# EAGLE design MyMacropad (EAGLE 9.6.2)
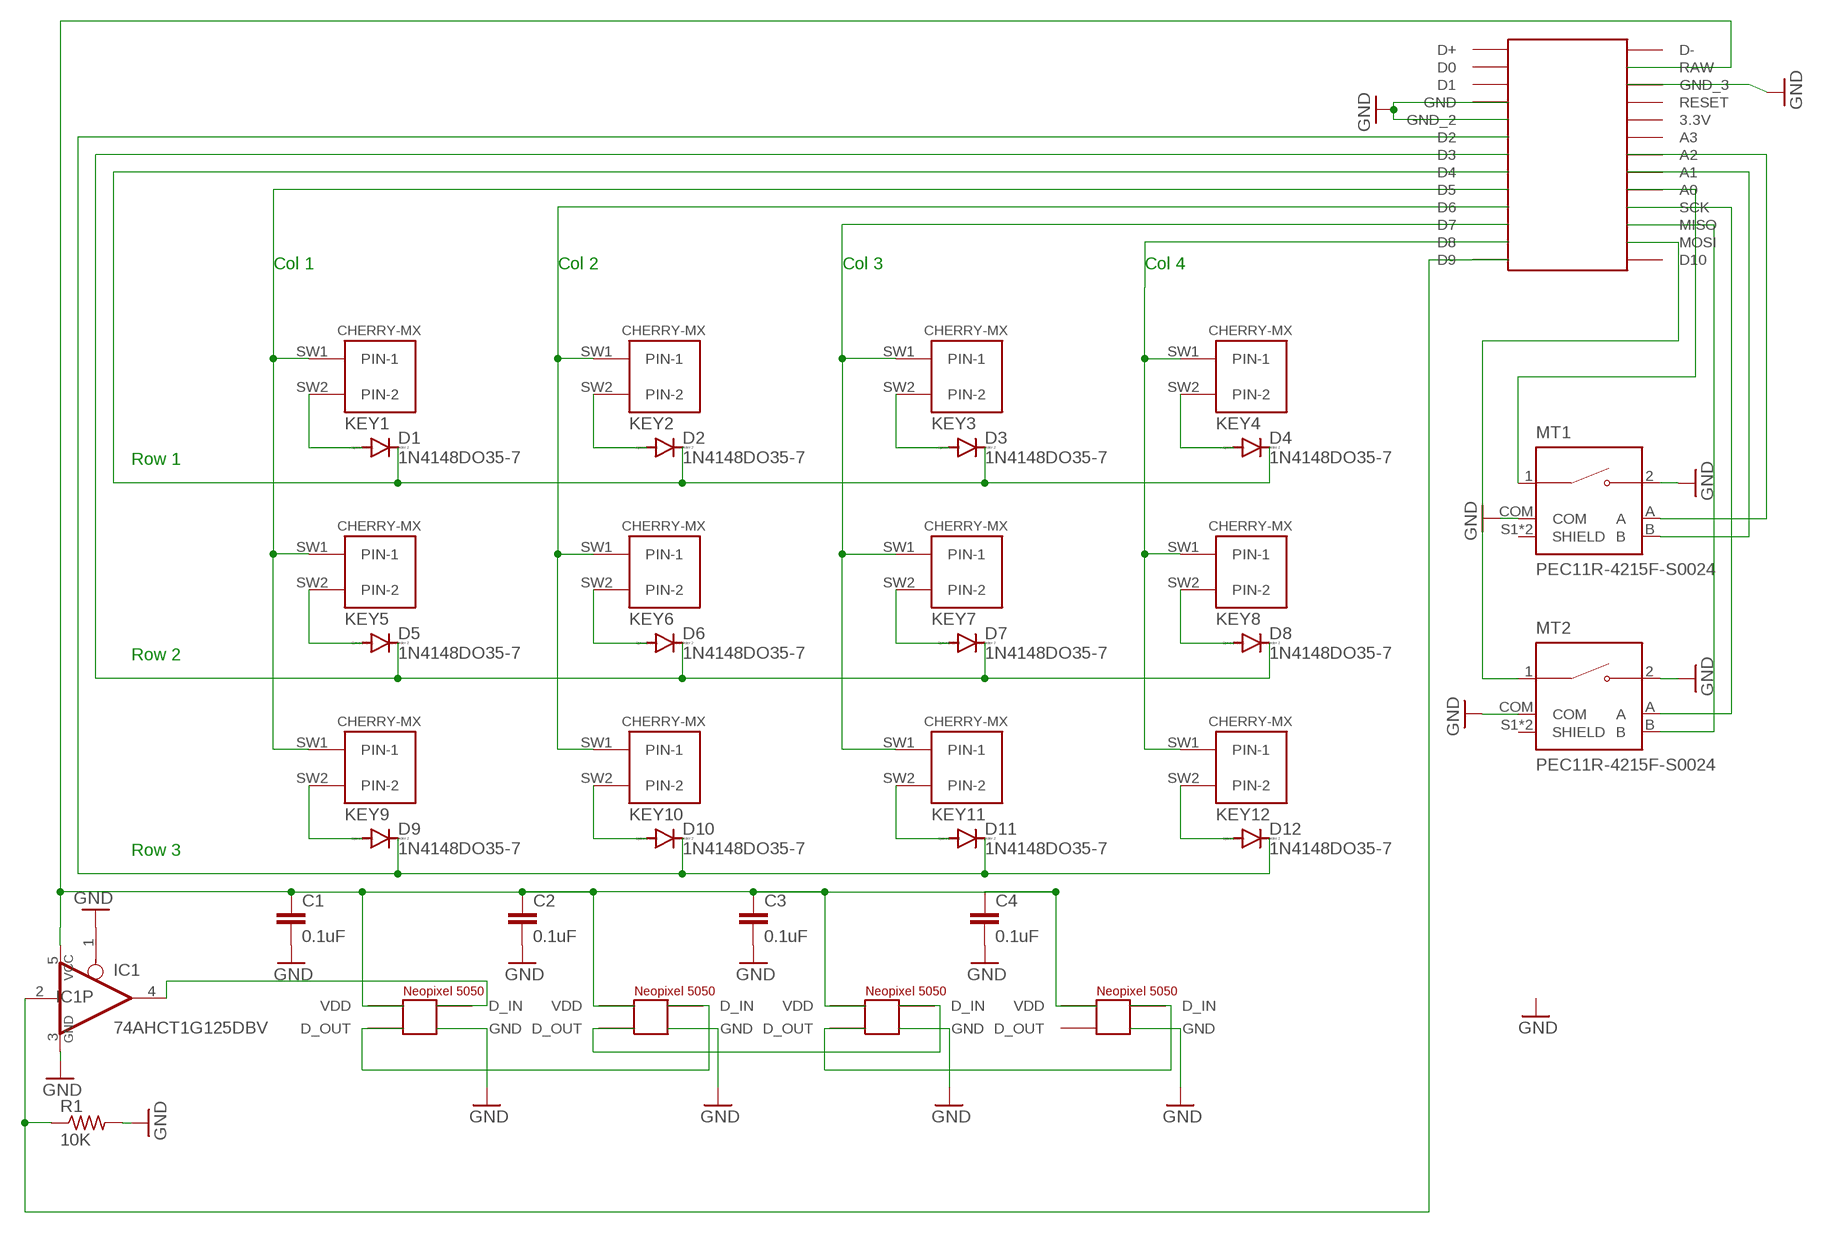
[diagram p0: schematic, sheet 1]

## Parts
C1  0.1uF  0.1UF-KIT-EZ-50V-20%  [CAP-PTH-SMALL-KIT]
C2  0.1uF  0.1UF-KIT-EZ-50V-20%  [CAP-PTH-SMALL-KIT]
C3  0.1uF  0.1UF-KIT-EZ-50V-20%  [CAP-PTH-SMALL-KIT]
C4  0.1uF  0.1UF-KIT-EZ-50V-20%  [CAP-PTH-SMALL-KIT]
D1  1N4148DO35-7  [DO35-7]
D2  1N4148DO35-7  [DO35-7]
D3  1N4148DO35-7  [DO35-7]
D4  1N4148DO35-7  [DO35-7]
D5  1N4148DO35-7  [DO35-7]
D6  1N4148DO35-7  [DO35-7]
D7  1N4148DO35-7  [DO35-7]
D8  1N4148DO35-7  [DO35-7]
D9  1N4148DO35-7  [DO35-7]
D10  1N4148DO35-7  [DO35-7]
D11  1N4148DO35-7  [DO35-7]
D12  1N4148DO35-7  [DO35-7]
IC1  74AHCT1G125DBV  [SOT23-5]
KEY1  CHERRY-MX  [CHERRY-MX]
KEY2  CHERRY-MX  [CHERRY-MX]
KEY3  CHERRY-MX  [CHERRY-MX]
KEY4  CHERRY-MX  [CHERRY-MX]
KEY5  CHERRY-MX  [CHERRY-MX]
KEY6  CHERRY-MX  [CHERRY-MX]
KEY7  CHERRY-MX  [CHERRY-MX]
KEY8  CHERRY-MX  [CHERRY-MX]
KEY9  CHERRY-MX  [CHERRY-MX]
KEY10  CHERRY-MX  [CHERRY-MX]
KEY11  CHERRY-MX  [CHERRY-MX]
KEY12  CHERRY-MX  [CHERRY-MX]
MT1  PEC11R-4215F-S0024  [XDCR_PEC11R-4215F-S0024]
MT2  PEC11R-4215F-S0024  [XDCR_PEC11R-4215F-S0024]
NEOPIXEL_1  NEOPIXEL_5050  [NEOPIXEL_5050]
NEOPIXEL_2  NEOPIXEL_5050  [NEOPIXEL_5050]
NEOPIXEL_3  NEOPIXEL_5050  [NEOPIXEL_5050]
NEOPIXEL_4  NEOPIXEL_5050  [NEOPIXEL_5050]
R1  10K  R-US_V234/12  [V234/12]
U$5  KB2040  [KB2040]

## Nets
GND: C1.2 C2.2 C3.2 C4.2 IC1.1(OE) IC1.3(GND) MT1.2 MT1.COM MT2.2 MT2.COM NEOPIXEL_1.GND NEOPIXEL_2.GND NEOPIXEL_3.GND NEOPIXEL_4.GND R1.2 U$5.GND U$5.GND_2 U$5.GND_3
N$1: KEY1.SW1(PIN-1) KEY5.SW1(PIN-1) KEY9.SW1(PIN-1) U$5.D5
N$2: KEY2.SW1(PIN-1) KEY6.SW1(PIN-1) KEY10.SW1(PIN-1) U$5.D6
N$3: KEY3.SW1(PIN-1) KEY7.SW1(PIN-1) KEY11.SW1(PIN-1) U$5.D7
N$4: D1.A KEY1.SW2(PIN-2)
N$5: KEY4.SW1(PIN-1) KEY8.SW1(PIN-1) KEY12.SW1(PIN-1) U$5.D8
N$6: D2.A KEY2.SW2(PIN-2)
N$7: D6.A KEY6.SW2(PIN-2)
N$8: D10.A KEY10.SW2(PIN-2)
N$9: D9.A KEY9.SW2(PIN-2)
N$10: D7.A KEY7.SW2(PIN-2)
N$11: D11.A KEY11.SW2(PIN-2)
N$12: D3.A KEY3.SW2(PIN-2)
N$13: D4.A KEY4.SW2(PIN-2)
N$14: D8.A KEY8.SW2(PIN-2)
N$15: D12.A KEY12.SW2(PIN-2)
N$16: D1.C D2.C D3.C D4.C U$5.D4
N$17: IC1.4(O) NEOPIXEL_1.D_IN
N$18: NEOPIXEL_3.D_OUT NEOPIXEL_4.D_IN
N$19: D5.A KEY5.SW2(PIN-2)
N$20: NEOPIXEL_1.D_OUT NEOPIXEL_2.D_IN
N$21: D5.C D6.C D7.C D8.C U$5.D3
N$22: D9.C D10.C D11.C D12.C U$5.D2
N$23: NEOPIXEL_2.D_OUT NEOPIXEL_3.D_IN
N$24: IC1.2(I) R1.1 U$5.D9
N$25: C1.1 C2.1 C3.1 C4.1 IC1.5(VCC) NEOPIXEL_1.VDD NEOPIXEL_2.VDD NEOPIXEL_3.VDD NEOPIXEL_4.VDD U$5.RAW
N$26: MT1.A U$5.A2
N$27: MT1.B U$5.A1
N$28: MT1.1 U$5.A0
N$29: MT2.1 U$5.MOSI
N$30: MT2.A U$5.SCK
N$31: MT2.B U$5.MISO
Unconnected: MT1.S1(SHIELD) MT1.S2(SHIELD) MT2.S1(SHIELD) MT2.S2(SHIELD) NEOPIXEL_4.D_OUT U$5.3.3V U$5.A3 U$5.D0 U$5.D1 U$5.D10 U$5.D+ U$5.D- U$5.RESET

## Notes on the sheet
- Col 1 | Col 2 | Col 3 | Col 4
- Row 1
- Row 2
- Row 3

## Library data of the parts
C1-C4 = SparkFun-Capacitors:0.1UF: 0.1µF ceramic capacitors A capacitor is a passive two-terminal electrical component used to store electrical energy temporarily in an electric field.; PROD_ID: CAP-08370
D1-D12 = diode:1N4148: DIODE high speed (Philips)
IC1 = 74xx-little-us:74*1G125: Single Bus Buffer Gate with 3-State Output
KEY1-KEY12 = cherrymx:CHERRY-MX: Cherry MX series keyswitch
MT1 MT2 = PEC11R-4215F-S0024:PEC11R-4215F-S0024: Incremental Encoder, 12 Mm, Contact Rating 10 Ma - 5 Vdc Check availability <https://pricing.snapeda.com/parts/PEC11R-4215F-S0024/Bourns/view-part?ref=eda>; AVAILABILITY: In Stock; DESCRIPTION: Rotary Encoder Mechanical 24 Quadrature (Incremental) Vertical; MF: Bourns; MP: PEC11R-4215F-S0024; PACKAGE: None; PRICE: None; PURCHASE-URL: https://pricing.snapeda.com/search/part/PEC11R-4215F-S0024/?ref=eda
NEOPIXEL_1-NEOPIXEL_4 = Neopixel 5050:NEOPIXEL_5050: Neopixel 5050 SMD Component
R1 = adafruit:R-US_: RESISTOR, American symbol
U$5 = KB2040:KB2040: Adafruit Kee Boar 2040 board

## Board
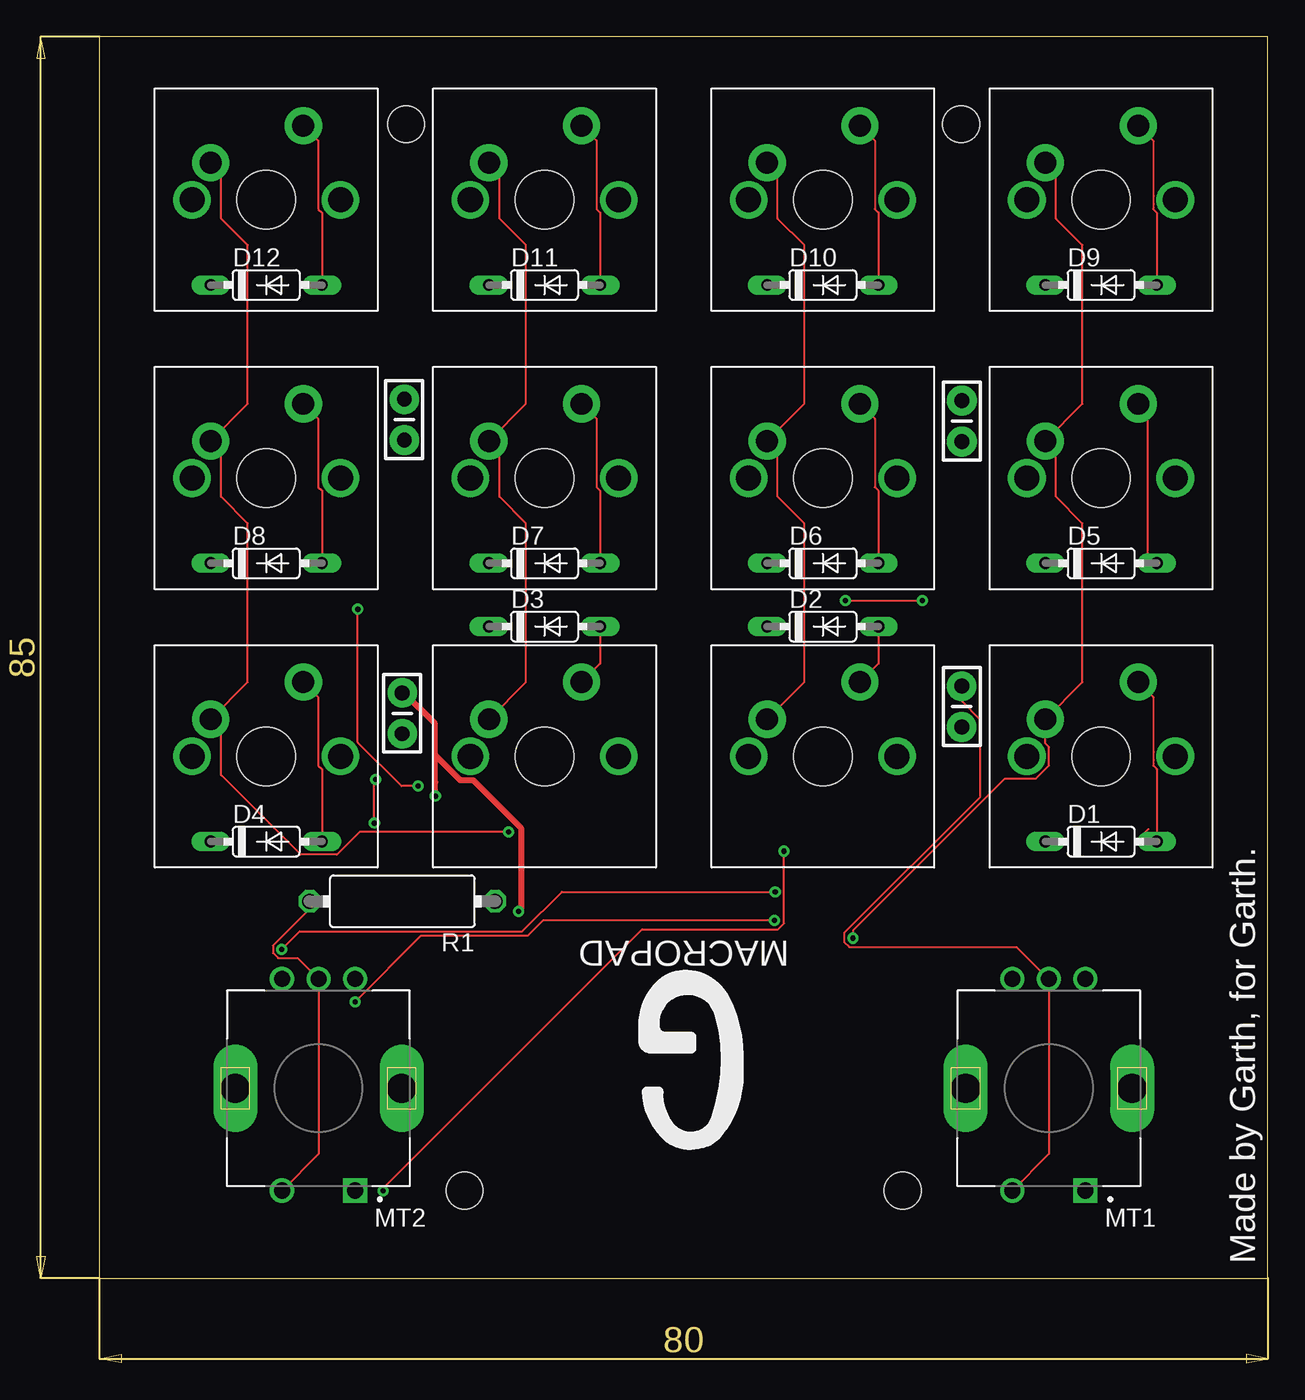
[diagram p1: board, top side]
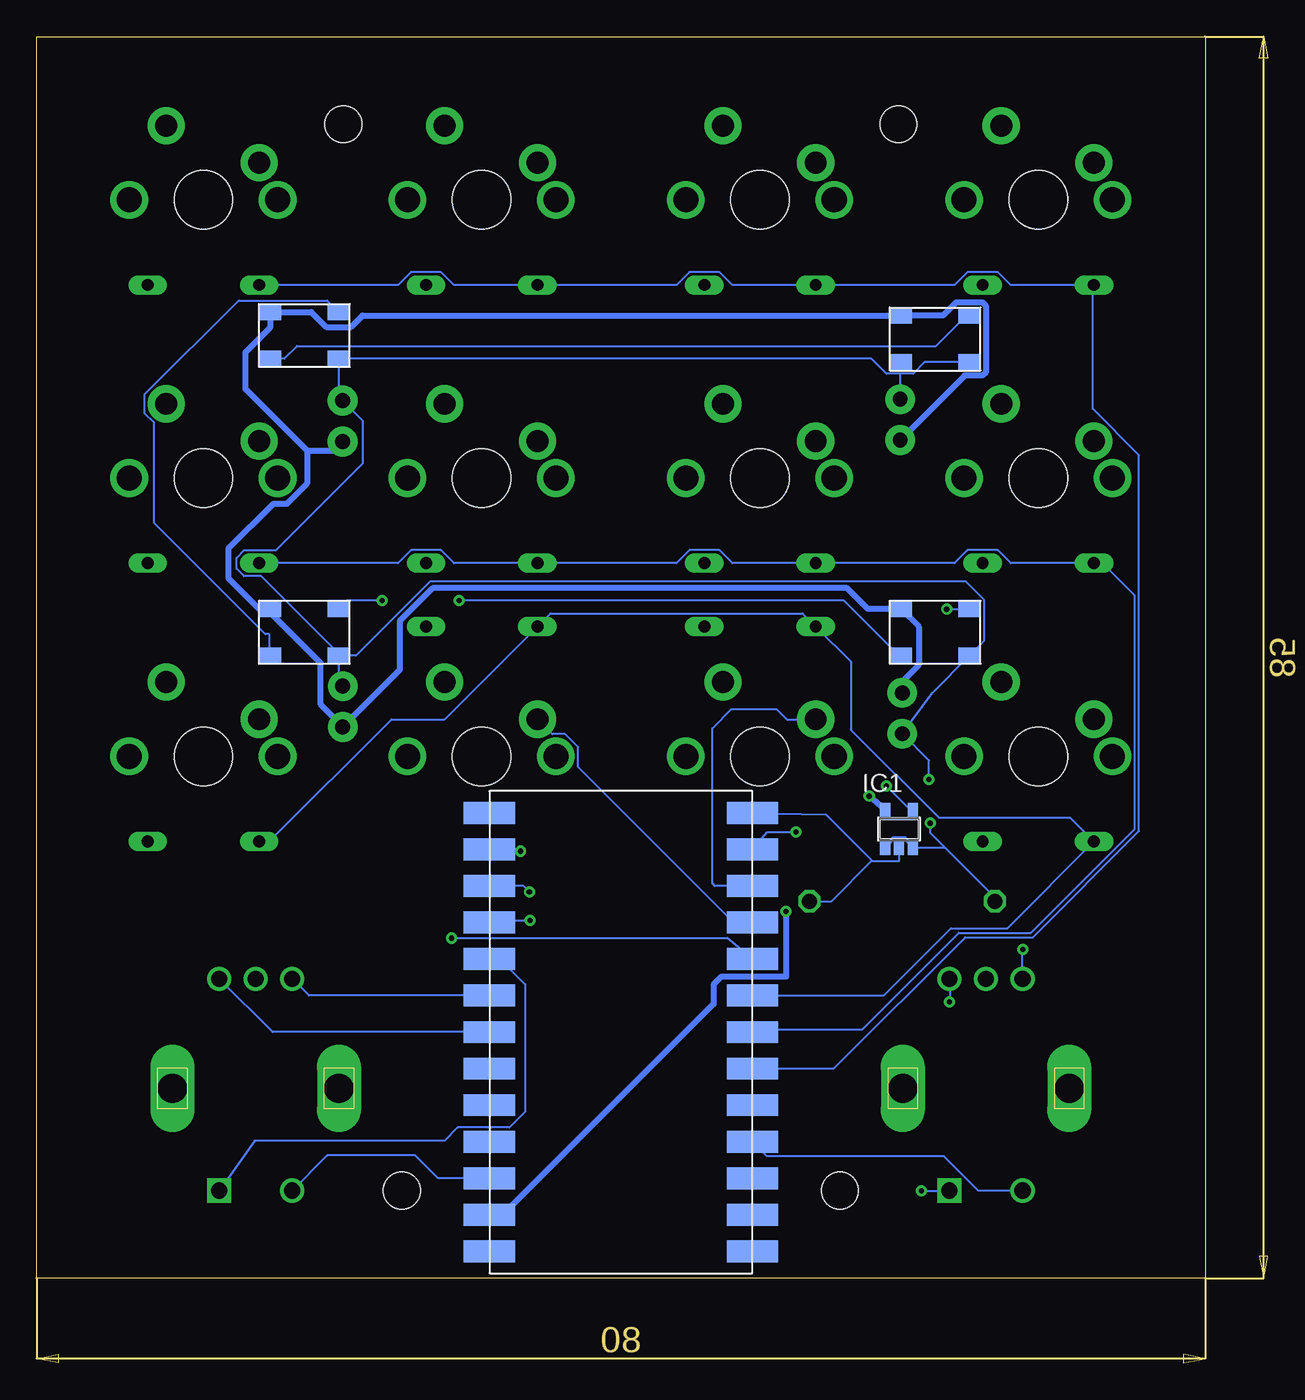
[diagram p2: board, bottom side, seen from below]

Size 80 x 85 mm. Coordinates in mm from the lower left corner, seen from the top.
Outline: 0,0 80,0 80,85 0,85 0,0
Copper layers (1*16): Top 0.035mm / dielectric 1.5mm / Bottom 0.035mm
Design rules "default": minimum track width 6mil, minimum drill 0.35mm, track to track 6mil, track to pad 6mil, pad to pad 6mil, via to via 6mil, smd to smd 6mil, copper to edge 40mil, drill to drill 6mil, minimum pad ring 10mil, minimum via ring 8mil, stop-mask expansion 4mil, vias tented up to drill 0mil, thermal gap 10mil
Holes 2.52 mm at 25,6 55,6 59,79 21,79

### Footprints (pad centres in the part's own frame; a part is rotated, then mirrored left to right if it is on the bottom)
CAP-PTH-SMALL-KIT = drill 1.016 pad 2.032: 1 -1.397,0; 2 1.397,0
DO35-7 = drill 0.813 long: A 3.81,0; C -3.81,0
SOT23-5 = smd 0.69 x 0.99: 1 -0.95,-1.29; 2 0,-1.29; 3 0.95,-1.29; 4 0.95,1.3; 5 -0.95,1.3
CHERRY-MX = drill 1.714 pad 1.93: P$3 -5.08,0; P$4 5.08,0 | drill 1.5 pad 2.54: SW1 -3.81,2.54; SW2 2.54,5.08 | hole 4: 0,0
XDCR_PEC11R-4215F-S0024 = drill 1.1 square: 1 -2.5,7 | drill 1.1: 2 2.5,7; A -2.5,-7.5; B 2.5,-7.5; COM 0,-7.5 | drill 2 long: S1 -5.7,0; S2 5.7,0
NEOPIXEL_5050 = smd 1.5 x 1.1: D_IN 5.45,3.75; D_OUT 0.75,0.55; GND 5.45,0.55; VDD 0.75,3.75
V234/12 = drill 1.016 octagon: 1 -6.35,0; 2 6.35,0
KB2040 = smd 3.5 x 1.5: 3.3V 18,21.5; A0 18,11.5; A1 18,14; A2 18,16.5; A3 18,19; D0 0,29; D1 0,26.5; D2 0,19; D3 0,16.5; D4 0,14; D5 0,11.5; D6 0,9; D7 0,6.5; D8 0,4; D9 0,1.5; D10 18,1.5; D+ 0,31.5; D- 18,31.5; GND 0,24; GND_2 0,21.5; GND_3 18,26.5; MISO 18,6.5; MOSI 18,4; RAW 18,29; RESET 18,24; SCK 18,9

### Placement (x,y rotation side)
C1  20.73,38.67 270 top
C2  59.03,39.13 90 top
C3  59.05,58.67 90 top
C4  20.88,58.77 90 top
D1  68.58,29.89 0 top
D2  49.52,44.62 0 top
D3  30.48,44.62 0 top
D4  11.43,29.89 0 top
D5  68.58,48.95 0 top
D6  49.52,48.95 0 top
D7  30.48,48.95 0 top
D8  11.43,48.95 0 top
D9  68.58,68 0 top
D10  49.52,68 0 top
D11  30.48,68 0 top
D12  11.43,68 0 top
IC1  20.95,30.75 0 bottom
KEY1  68.58,35.73 0 top
KEY2  49.52,35.73 0 top
KEY3  30.48,35.73 0 top
KEY4  11.43,35.73 0 top
KEY5  68.58,54.77 0 top
KEY6  49.52,54.77 0 top
KEY7  30.48,54.77 0 top
KEY8  11.43,54.77 0 top
KEY9  68.58,73.83 0 top
KEY10  49.52,73.83 0 top
KEY11  30.48,73.83 0 top
KEY12  11.43,73.83 0 top
MT1  65,13 180 top
MT2  15,13 180 top
NEOPIXEL_1  21.59,42.08 0 bottom
NEOPIXEL_2  64.77,42.08 0 bottom
NEOPIXEL_3  64.77,62.4 0 bottom
NEOPIXEL_4  21.59,62.15 0 bottom
R1  20.75,25.8 180 top
U$5  31,33.35 180 bottom

### Tracks (layer width: path | path; a pad name or v marks a point on that pad's centre or on a via)
GND  (via drill 0.35)
  Top 0.152: v18.82,31.15 18.82,34.05 v18.91,34.13 | R1.2 14.39,25.28 11.88,22.77 11.88,22.27 12.24,21.91 13.59,21.91 MT2.COM 15,8.5 MT2.2 | MT1.COM 65,20.45 | 65,20.45 65,8.5 MT1.2 | C2.2 59.03,39.5 60.28,38.25 60.28,32.92 50.98,23.62 50.98,23.03 51.34,22.67 62.78,22.67 65,20.45
  Bottom 0.152: NEOPIXEL_4.GND 19.21,62.7 19.99,61.92 20.88,61.92 | NEOPIXEL_2.GND 59.31,42.75 64.62,48.06 65.79,48.06 66.31,48.58 66.31,49.31 65.79,49.83 63.6,49.83 57.65,55.79 57.65,58.68 C3.2 59.31,60.34 NEOPIXEL_3.GND 22.84,62.95 21.81,61.92 20.88,61.92 | NEOPIXEL_2.GND 58.12,42.62 53.06,47.69 16.38,47.69 15.16,46.47 15.16,43.6 NEOPIXEL_1.GND 18.69,40.07 C1.2 18.91,35.45 v18.91,34.13 | NEOPIXEL_2.GND 59.31,40.81 C2.2 | C4.2 20.88,61.92 | 17.8,29.45 14.39,26.05 R1.2 | 17.8,29.45 IC1.3 20.38,29.83 20.38,30.05 20.52,30.18 21.39,30.18 21.53,30.05 21.53,29.83 IC1.1 | 17.8,29.45 18.82,30.48 v18.82,31.15 | U$5.GND_3 52.52,6.85 54.08,8.4 60.1,8.4 MT1.2 | MT2.2 15.53,6 17.88,8.35 30,8.35 U$5.GND U$5.GND_2
N$1  (via drill 0.35)
  Top 0.152: KEY9.SW1 65.48,75.65 65.48,72.54 67.31,70.72 67.31,59.85 KEY5.SW1 65.48,56.6 65.48,53.49 67.31,51.67 67.31,40.8 KEY1.SW1 64.77,36.6 65.01,36.35 65.01,35.1 64.12,34.21 62,34.21 51.59,23.8 v51.59,23.28
  Bottom 0.152: v51.59,23.28 32.74,23.28 U$5.D5
N$2
  Top 0.152: 45.96,76.12 KEY10.SW1 46.43,75.65 46.43,72.54 48.26,70.72 48.26,59.85 KEY6.SW1 46.43,56.6 46.43,53.49 48.26,51.67 48.26,40.8 KEY2.SW1
  Bottom 0.152: KEY2.SW1 44.69,37.24 43.82,37.24 42.93,36.35 42.93,34.99 32.19,24.25 U$5.D6
N$3
  Top 0.152: 26.91,76.12 KEY11.SW1 27.38,75.65 27.38,72.54 29.2,70.72 29.2,59.85 KEY7.SW1 27.38,56.6 27.38,53.49 29.2,51.67 29.2,40.8 KEY3.SW1
  Bottom 0.152: U$5.D7 33.58,26.85 33.74,27.01 33.74,37.64 32.42,38.96 29.33,38.96 28.64,38.27 KEY3.SW1
N$4
  Top 0.152: 71.82,30.74 70.97,29.89 D1.A 72.39,34.85 72.14,35.1 72.14,39.78 KEY1.SW2
N$5  (via drill 0.35)
  Top 0.152: KEY12.SW1 8.33,75.65 8.33,72.54 10.15,70.72 10.15,59.85 KEY8.SW1 8.33,56.6 8.33,53.49 10.15,51.67 10.15,40.8 KEY4.SW1 8.33,37.55 8.33,34.44 13.77,29.01 16.26,29.01 17.8,30.55 v28,30.55
  Bottom 0.152: U$5.D8 29.95,30.55 v28,30.55
N$6
  Top 0.152: 52.67,44.62 D2.A 53.34,42.08 KEY2.SW2
N$7
  Top 0.152: D6.A 53.34,53.9 53.09,54.15 53.09,58.83 KEY6.SW2
N$8
  Top 0.152: D10.A 53.34,72.95 53.09,73.2 53.09,77.88 KEY10.SW2
N$9
  Top 0.152: 71.72,68 D9.A 72.39,72.95 72.14,73.2 72.14,77.88 KEY9.SW2
N$10
  Top 0.152: D7.A 34.28,53.9 34.04,54.15 34.04,58.83 KEY7.SW2
N$11
  Top 0.152: 33.72,78.2 KEY11.SW2 34.04,77.88 34.04,73.2 34.28,72.95 D11.A 33.62,68
N$12
  Top 0.152: KEY3.SW2 34.28,42.08 D3.A
N$13
  Top 0.152: D4.A 15.23,34.85 14.99,35.1 14.99,39.78 KEY4.SW2
N$14
  Top 0.152: D8.A 15.23,53.9 14.99,54.15 14.99,58.83 KEY8.SW2
N$15
  Top 0.152: D12.A 15.23,72.95 14.99,73.2 14.99,77.88 KEY12.SW2
N$16
  Bottom 0.152: D1.C 64.08,29.89 55.7,38.27 52.06,38.27 D2.C 44.83,45.5 27.55,45.5 D3.C 26.57,44.52 24.25,42.22 24.25,37.55 18.24,31.53 9.25,31.53 D4.C 13.56,23.95 17.39,23.95 22,19.35 U$5.D4
N$17  (via drill 0.35)
  Top 0.152: v21.83,33.7 20.68,33.7 17.7,36.68 v17.7,45.8
  Bottom 0.152: v21.83,33.7 20.18,32.05 IC1.4 | v17.7,45.8 16.16,45.8 NEOPIXEL_1.D_IN
N$18
  Bottom 0.152: NEOPIXEL_3.D_OUT 63.05,62.95 62.17,63.81 18.43,63.81 16.34,65.89 NEOPIXEL_4.D_IN
N$19
  Top 0.152: 71.72,48.95 D5.A 71.74,49.59 71.74,59.23 KEY5.SW2
N$20  (via drill 0.35)
  Top 0.152: v51.06,46.38 v56.35,46.38
  Bottom 0.152: v51.06,46.38 24.73,46.38 20.98,42.62 NEOPIXEL_1.D_OUT | v56.35,46.38 58.76,46.38 NEOPIXEL_2.D_IN
N$21
  Top 0.152: 8.28,48.95 D8.C
  Bottom 0.152: D5.C 55.25,48.95 54.36,49.83 52.31,49.83 51.42,48.95 D6.C 36.2,48.95 35.31,49.83 33.26,49.83 32.37,48.95 D7.C 17.15,48.95 16.26,49.83 14.21,49.83 13.32,48.95 D8.C 7.04,48.95 4.83,46.73 4.83,30.75 11.93,23.65 16.86,23.65 23.48,17.03 31.15,17.03 U$5.D3
N$22
  Top 0.152: 8.28,68 D12.C
  Bottom 0.152: D9.C 55.25,68 54.36,68.88 52.31,68.88 51.42,68 D10.C 36.2,68 35.31,68.88 33.26,68.88 32.37,68 D11.C 17.15,68 16.26,68.88 14.21,68.88 13.32,68 7.71,68 | D12.C 7.71,68 | 7.71,68 7.71,59.52 4.53,56.34 4.53,30.6 11.79,23.34 16.43,23.34 25.42,14.35 U$5.D2
N$23
  Bottom 0.152: NEOPIXEL_3.D_IN 60.1,66.93 66.16,66.93 72.61,60.48 72.61,59.23 71.97,58.59 71.97,51.73 64.34,44.1 64.08,44.1 64.08,42.69 NEOPIXEL_2.D_OUT
N$24
  Bottom 0.152: U$5.D9 25.98,31.75 22.82,28.59 | IC1.2 20.95,28.57 22.8,28.57 22.82,28.59 | R1.1 25.59,25.8 22.82,28.59
N$25  (via drill 0.35)
  Top 0.406: v28.68,25.1 28.86,25.28 28.86,30.84 25.61,34.08 24.71,34.08 22.98,35.82 22.98,37.1 | C1.1 20.88,40.07 22.97,37.97 22.98,37.1 | v23,33 23,33.95 22.98,37.1
  Bottom 0.152: U$5.RAW 48.95,4.3 48.12,4.3
  Bottom 0.406: C1.1 20.73,40.85 19.61,41.98 19.61,44.6 NEOPIXEL_1.VDD 23.1,45.83 24.52,47.24 52.88,47.24 55.13,44.98 55.13,41.64 C2.1 59.03,37.77 60.54,39.28 60.54,42.1 64.02,45.58 NEOPIXEL_2.VDD 64.75,45.83 66.87,47.95 66.87,49.94 63.8,53.01 62.87,53.01 61.48,54.4 61.48,56.65 | v28.68,25.1 28.68,20.63 33.13,20.63 33.66,20.11 33.66,18.77 48.12,4.3 | 61.48,56.65 65.72,60.89 65.72,63.37 64.02,65.07 NEOPIXEL_3.VDD 61.19,66.14 60.16,65.12 58.47,65.12 57.69,65.89 NEOPIXEL_4.VDD 17.94,65.89 17.03,66.8 15.24,66.8 15.03,66.59 15.03,62 15.24,61.79 16.46,61.79 C4.1 | 61.48,56.65 59.67,56.65 C3.1 | IC1.5 v23,33
N$26
  Bottom 0.152: U$5.A2 63.85,16.85 MT1.A
N$27
  Bottom 0.152: MT1.B 61.35,19.35 U$5.A1
N$28
  Bottom 0.152: MT1.1 65.07,9.41 52.08,9.41 51.17,10.33 47.62,10.33 46.55,11.4 46.55,20.13 48.22,21.8 U$5.A0
N$29  (via drill 0.35)
  Top 0.152: v19.42,5.98 19.42,6.16 37.16,23.89 46.47,23.89 46.87,24.3 v46.87,29.23
  Bottom 0.152: MT2.1 17.52,5.98 v19.42,5.98 | U$5.MOSI v46.88,29.23 v46.87,29.23
N$30  (via drill 0.35)
  Top 0.152: v46.22,24.5 30.37,24.5 29.31,23.44 22.01,23.44 v17.5,18.93
  Bottom 0.152: U$5.SCK 49.3,24.49 v46.22,24.5 | v17.5,18.93 17.48,18.95 17.48,20.53 MT2.A
N$31  (via drill 0.35)
  Top 0.152: v46.27,26.45 31.66,26.45 28.95,23.74 13.71,23.74 v12.49,22.52
  Bottom 0.152: MT2.B v12.5,22.51 v12.49,22.52 | U$5.MISO 49.25,26.85 46.66,26.85 v46.27,26.45

### Text on the board
tPlace: MACROPAD | Made by Garth, for Garth.